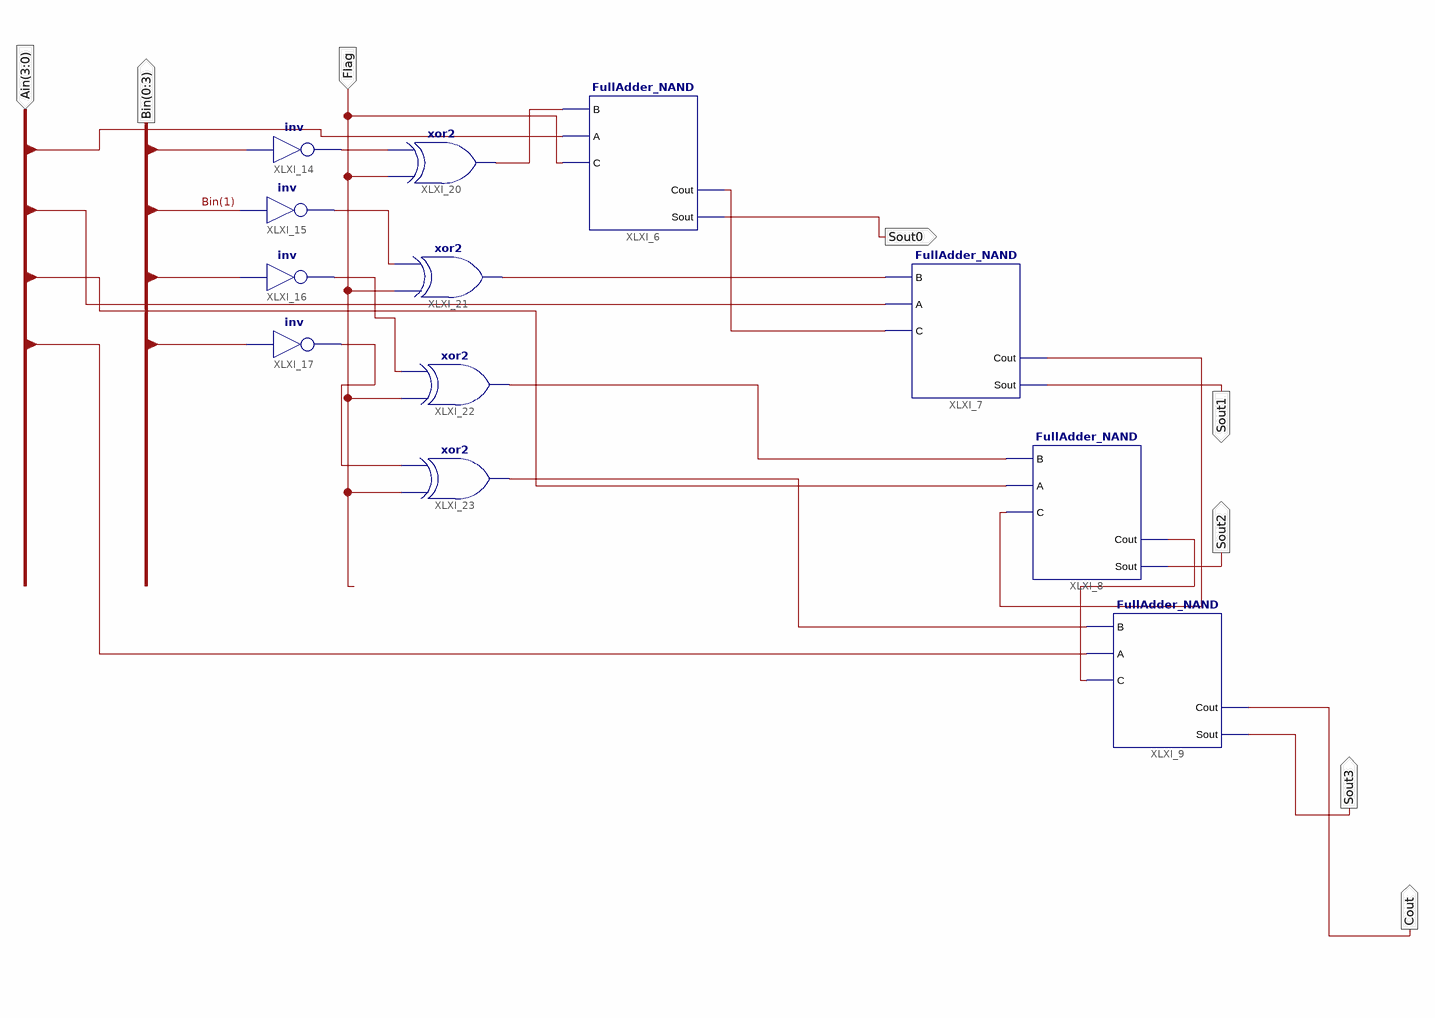
[diagram p0: schematic sheet 1]
// Xilinx ISE schematic FourBitParallelAdder.sch (spartan3e) as structural Verilog: 12 symbols, 8 ports
module FourBitParallelAdder (
  input  [3:0] Ain,
  input  Flag,
  output Sout0,
  output Sout1,
  output Sout2,
  output Sout3,
  output Cout,
  output [0:3] Bin
);

  wire XLXN_30, XLXN_31, XLXN_91;

  FullAdder_NAND XLXI_9 (.B(Bin[3]), .A(Ain[3]), .C(XLXN_31), .Cout(Cout), .Sout(Sout3));
  FullAdder_NAND XLXI_7 (.B(Bin[1]), .A(Ain[1]), .C(XLXN_91), .Cout(XLXN_30), .Sout(Sout1));
  FullAdder_NAND XLXI_8 (.B(Bin[2]), .A(Ain[2]), .C(XLXN_30), .Cout(XLXN_31), .Sout(Sout2));
  not XLXI_14 (Bin[0], Bin[0]);
  not XLXI_15 (Bin[1], Bin[1]);
  not XLXI_16 (Bin[2], Bin[2]);
  not XLXI_17 (Bin[3], Bin[3]);
  FullAdder_NAND XLXI_6 (.B(Bin[0]), .A(Ain[0]), .C(Flag), .Cout(XLXN_91), .Sout(Sout0));
  xor XLXI_20 (Bin[0], Flag, Bin[0]);
  xor XLXI_21 (Bin[1], Flag, Bin[1]);
  xor XLXI_22 (Bin[2], Flag, Bin[2]);
  xor XLXI_23 (Bin[3], Flag, Bin[3]);
endmodule
